# Altium schematic sheet USB_PD_Sink_CYPD3177.SchDoc
size A4
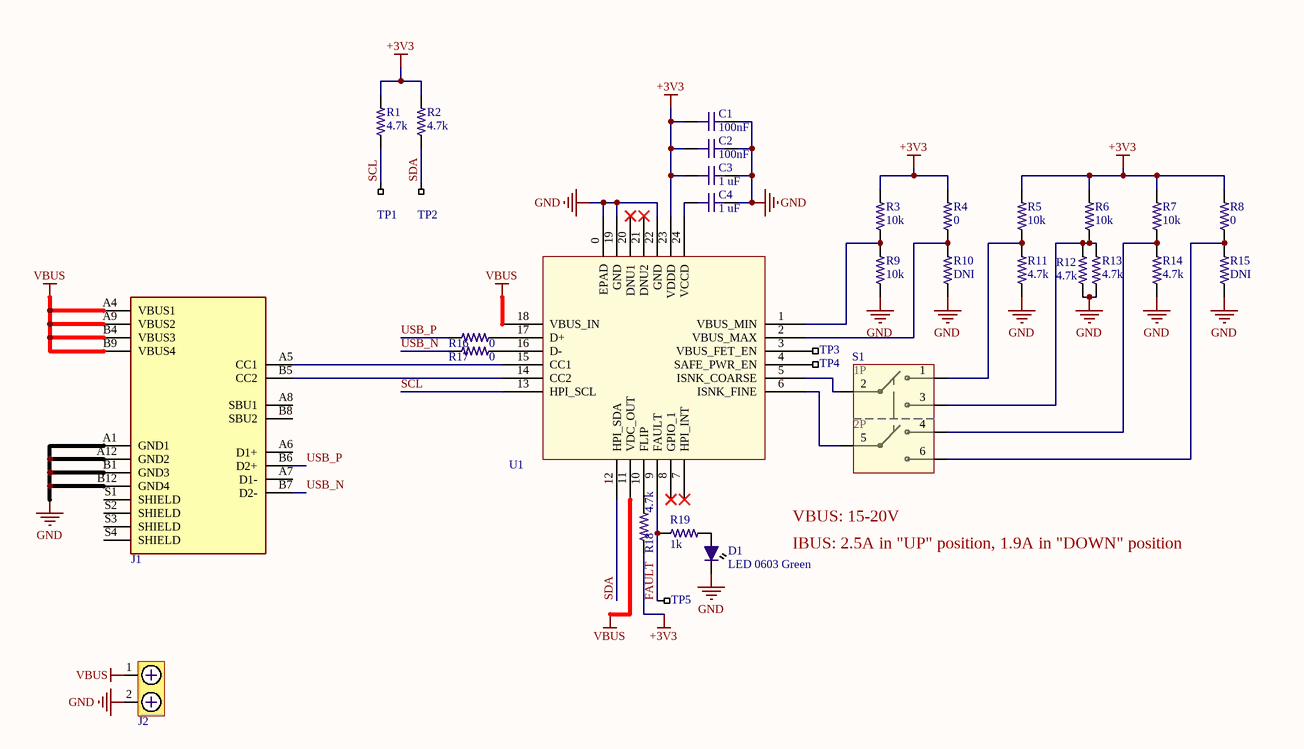
[diagram p0: USB_PD_Sink_CYPD3177.SchDoc]

## Parts
C1  value 100nF  [C0603-IPC]  (hidden comment: C0603 100nF 25V X7R)
C2  value 100nF  [C0603-IPC]  (hidden comment: C0603 100nF 25V X7R)
C3  value 1 uF  [C0603-IPC]  (hidden comment: C0603 1uF 10V X7R)
C4  value 1 uF  [C0603-IPC]  (hidden comment: C0603 1uF 10V X7R)
D1  LED 0603 Green  [LED0603-IPC]
J1  16 Pin Mid Mount USB C  [USB-C - 16 Pin Mid Mount]  (value not drawn)
J2  Phoenix Contact 1935161  [Phoenix_1935161]  (value not drawn)
R1  value 4.7k  [R0603-HIGH-DENSITY]  (hidden comment: R0603 4.7k 1%)
R2  value 4.7k  [R0603-HIGH-DENSITY]  (hidden comment: R0603 4.7k 1%)
R3  value 10k  [R0603-IPC]  (hidden comment: R0603 10K 1%)
R4  value 0  [R0603-IPC]  (hidden comment: R0603 0)
R5  value 10k  [R0603-IPC]  (hidden comment: R0603 10K 1%)
R6  value 10k  [R0603-IPC]  (hidden comment: R0603 10K 1%)
R7  value 10k  [R0603-IPC]  (hidden comment: R0603 10K 1%)
R8  value 0  [R0603-IPC]  (hidden comment: R0603 0)
R9  value 10k  [R0603-IPC]  (hidden comment: R0603 10K 1%)
R10  value DNI  [R0603-IPC]  (hidden comment: R0603 0)
R11  value 4.7k  [R0603-IPC]  (hidden comment: R0603 4.7k 1%)
R12  value 4.7k  [R0603-IPC]  (hidden comment: R0603 4.7k 1%)
R13  value 4.7k  [R0603-IPC]  (hidden comment: R0603 4.7k 1%)
R14  value 4.7k  [R0603-IPC]  (hidden comment: R0603 4.7k 1%)
R15  value DNI  [R0603-IPC]  (hidden comment: R0603 0)
R16  value 0  [R0402-HIGH-DENSITY]  (hidden comment: R0402 0R)
R17  value 0  [R0402-HIGH-DENSITY]  (hidden comment: R0402 0R)
R18  value 4.7k  [R0603-HIGH-DENSITY]  (hidden comment: R0603 4.7k 1%)
R19  value 1k  [R0603-IPC]  (hidden comment: R0603 1K 1%)
S1  SS-3235S-L3  [SS-3235S-L3]  (value not drawn)
TP1  SCL  [TESTPOINT_SMT]  (value not drawn)  (no BOM)
TP2  SDA  [TESTPOINT_SMT]  (value not drawn)  (no BOM)
TP3  VBUS_FET_EN  [TESTPOINT_SMT]  (value not drawn)  (no BOM)
TP4  SAFE_PWR_EN  [TESTPOINT_SMT]  (value not drawn)  (no BOM)
TP5  FAULT  [TESTPOINT_SMT]  (value not drawn)  (no BOM)
U1  CYPD3177 PD Sink Controller  [QFN24 - 4X4MM - PITCH 0.5MM - EXPOSEDPAD]  (value not drawn)

## Nets
+3V3: C1.1 C2.1 C3.2 R1.1 R2.1 R3.2 R4.2 R5.2 R6.2 R7.2 R8.2 R18.2 U1.23(VDDD)
GND: C1.2 C2.2 C3.1 C4.1 D1.K J1.A1(GND1) J1.A12(GND2) J1.B1(GND3) J1.B12(GND4) J2.2 R9.1 R10.1 R11.1 R12.1 R13.1 R14.1 R15.1 U1.0(EPAD) U1.19(GND) U1.22(GND)
VBUS: J1.A4(VBUS1) J1.A9(VBUS2) J1.B4(VBUS3) J1.B9(VBUS4) J2.1 U1.11(VDC_OUT) U1.18(VBUS_IN)
FAULT: R19.1 TP5.1 U1.9(FAULT)
SCL: R1.2 TP1.1 U1.13(HPI_SCL)
SDA: R2.2 TP2.1 U1.12(HPI_SDA)
USB_N: J1.B7(D2-) R17.1
USB_P: J1.B6(D2+) R16.1
NetC4_2: C4.2 U1.24(VCCD)
NetD1_A: D1.A R19.2
NetJ1_A5: J1.A5(CC1) U1.15(CC1)
NetJ1_B5: J1.B5(CC2) U1.14(CC2)
NetR3_1: R3.1 R9.2 U1.1(VBUS_MIN)
NetR4_1: R4.1 R10.2 U1.2(VBUS_MAX)
NetR5_1: R5.1 R11.2 S1.1
NetR6_1: R6.1 R12.2 R13.2 S1.3
NetR7_1: R7.1 R14.2 S1.4
NetR8_1: R8.1 R15.2 S1.6
NetR16_2: R16.2 U1.17(D+)
NetR17_2: R17.2 U1.16(D-)
NetR18_1: R18.1 U1.10(FLIP)
NetS1_2: S1.2 U1.5(ISNK_COARSE)
NetS1_5: S1.5 U1.6(ISNK_FINE)
NetTP3_1: TP3.1 U1.3(VBUS_FET_EN)
NetTP4_1: TP4.1 U1.4(SAFE_PWR_EN)

Not connected (* = marked no-connect by the designer): J1 A6(D1+) A7(D1-) A8(SBU1) B8(SBU2) S1(SHIELD) S2(SHIELD) S3(SHIELD) S4(SHIELD); U1 7(HPI_INT)* 8(GPIO_1)* 20(DNU1)* 21(DNU2)*

## Notes on the sheet
- VBUS: 15-20V
- IBUS: 2.5A in "UP" position, 1.9A in "DOWN" position
- (in symbol Slide Switch DPDT SMD) 1P; 2P

## Library data of the parts
C1 C2 = C0603 100nF 25V X7R: Chip Capacitor, 0603, 100nF, 25V, X7R; EIA Code: X7R; Max. Voltage: 25V; Supplier 1: Digi-Key; Supplier Part Number 1: 490-1524-1-ND
C3 C4 = C0603 1uF 10V X7R: Chip Capacitor, 0603, 1uF +/- 0.1uF, 10V, X7R; Supplier 1: Digi-Key; Supplier Part Number 1: 1276-1946-1-ND; Max. Voltage: 10V; EIA Code: X7R
D1 = LED 0603 Green: LED GREEN CLEAR 0603 SMD; Supplier 1: Digi-Key; Supplier Part Number 1: 732-4971-1-ND
J1 = USB C USB 2.0 and PD: USB-C USB 2.0 5A PD 16 Position Mid Mount; Manufacturer: Jing Extension of the Electronic Co; Supplier 1: LCSC; Supplier Part Number 1: C168688
J2 = Term Block 2pos: Terminal Block, 2 Position, 5mm pitch, 18A, 300V, 12-26 AWG; Manufacturer: Phoenix Contact; Manufacturer Part Number: 1935161; Supplier 1: Digi-Key; Supplier Part Number 1: 277-1667-ND
R1 R2 R11-R14 R18 = R0603 4.7k 1%: Chip Resistor, 0603, 4.7k ohms, 0.1W; Supplier 1: Digi-Key; Supplier Part Number 1: 311-4.70KHRCT-ND
R3 R5-R7 R9 = R0603 10K 1%: RES SMD 10K OHM 1% 1/10W 0603; Supplier 1: Digi-Key; Supplier Part Number 1: RMCF0603FT10K0CT-ND
R4 R8 R10 R15 = R0603 0: RES SMD 0 OHM JUMPER 1/10W 0603; Supplier 1: Digi-Key; Supplier Part Number 1: RMCF0603ZT0R00CT-ND
R16 R17 = R0402 0R: Chip Resistor, 0402, 0 ohm jumper; Supplier 1: Digi-Key; Supplier Part Number 1: 311-0.0JRCT-ND
R19 = R0603 1K 1%: RES SMD 1K OHM 1% 1/10W 0603; Temperature Coefficient: ±100ppm/°C; Operating Temperature: -55°C ~ 155°C; Features: Automotive AEC-Q200; Tolerance: ±1%; Supplier 1: Digi-Key; Supplier Part Number 1: RMCF0603FG1K00CT-ND
S1 = Slide Switch DPDT SMD: DPDT 50mA @ 12VDC 12V On-On SMD Toggle Switches RoHS; Supplier 3: LCSC; Supplier Part Number 3: C381098; Manufacturer Part Number: SS-3235S-L3
TP1-TP5 = Testpoint_SMT: SMT Test Point
U1 = CYPD3177: IC USB TYPE-C PD PORT CONTROL 24QFN; Supplier 1: Digi-Key; Supplier 2: Mouser; Supplier Part Number 1: 428-4652-ND; Supplier Part Number 2: 727-CYPD3177-24LQXQ